# Altium project flight_controller.PrjPcb (part 1 of 3)
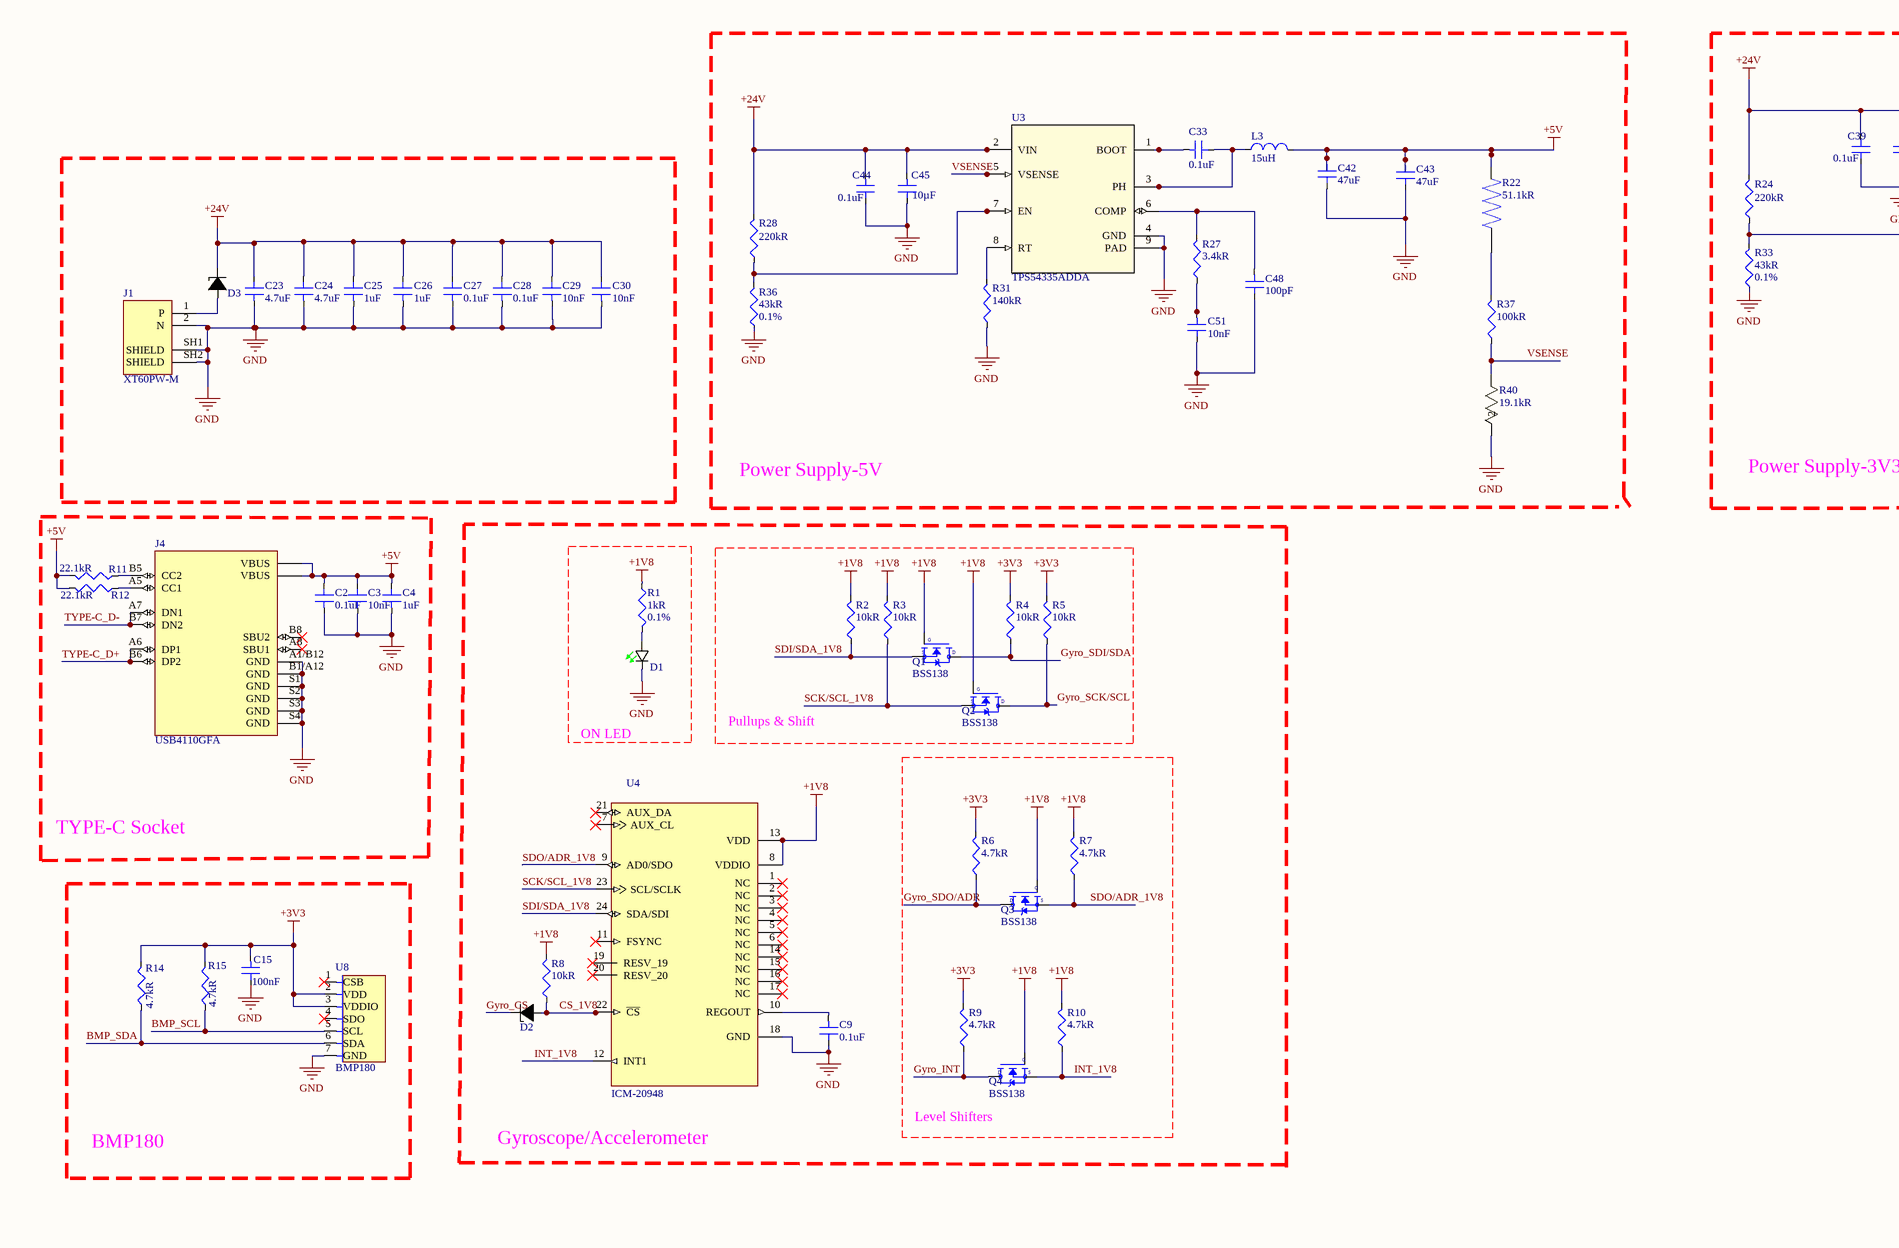
[diagram p0: Sheet1.SchDoc, top left]
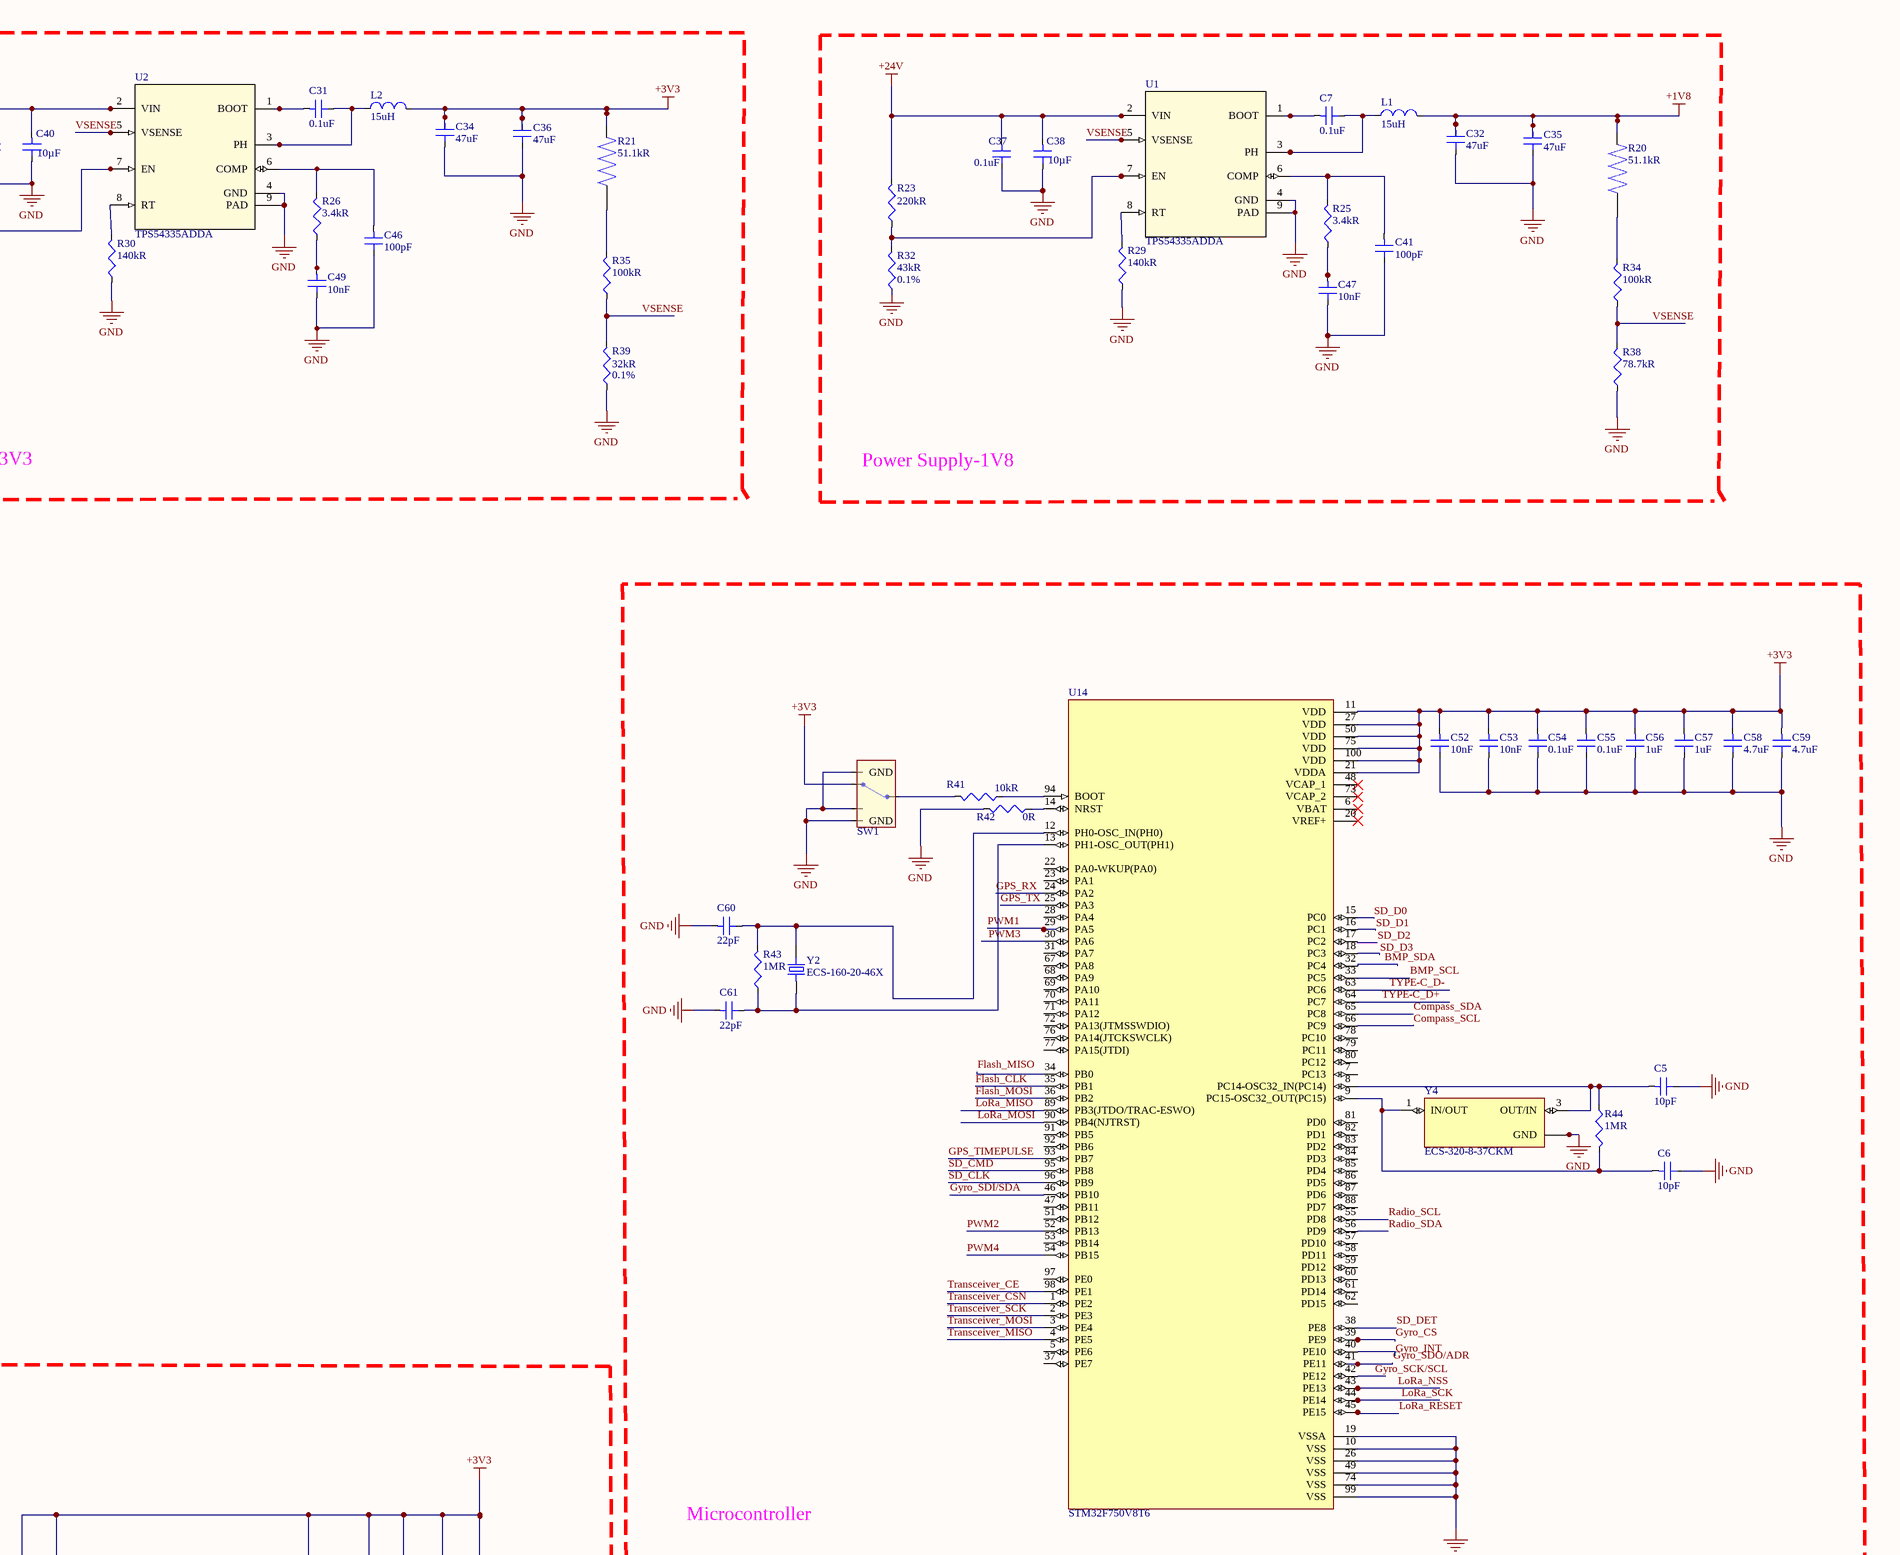
[diagram p1: Sheet1.SchDoc, top right]
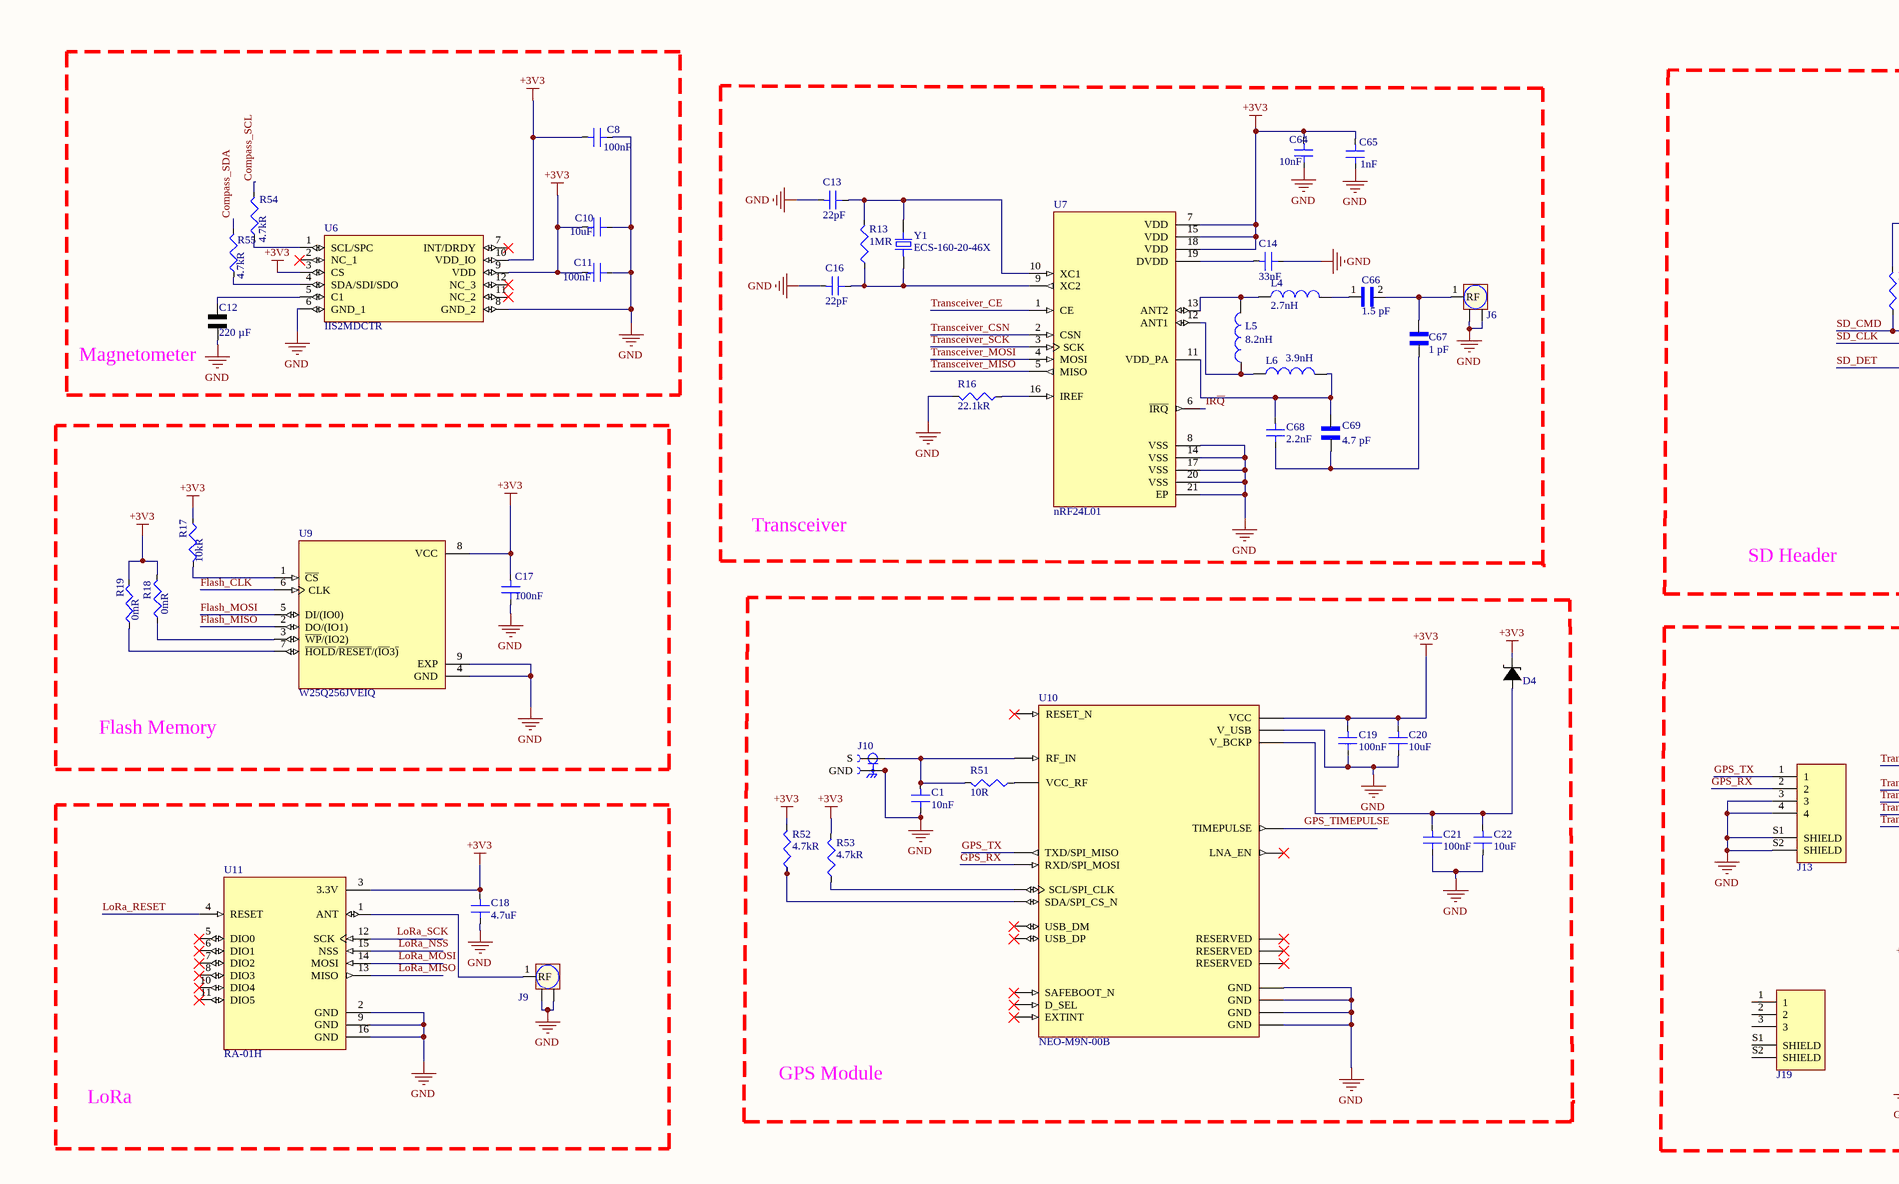
[diagram p2: Sheet1.SchDoc, bottom left]
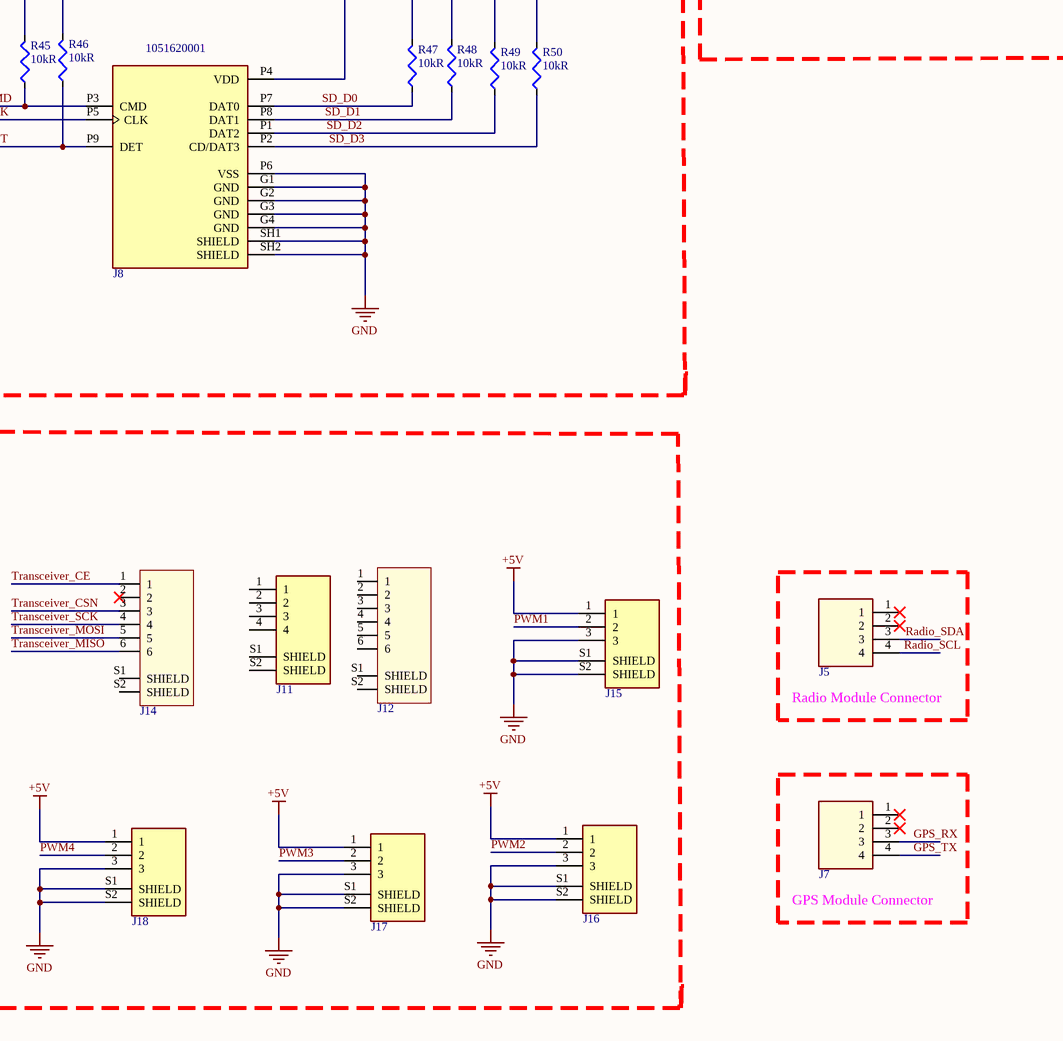
[diagram p3: Sheet1.SchDoc, bottom right]
1 sheet, 167 parts. Net scope: global (net labels, ports and power ports of the same name join across sheets).
Board file: PCB1.PcbDoc

## Sheet Sheet1.SchDoc
size A1; SheetNumber: 1; SheetTotal: 1

### Parts
C1  value 10nF  [C 0402 (1005 Metric)]  (hidden comment: GRM155R71H103MA88D)
C2  value 0.1uF  [C 0402 (1005 Metric)]  (hidden comment: GCM155L81E104KE02D)
C3  value 10nF  [C 0402 (1005 Metric)]  (hidden comment: GRM155R71H103MA88D)
C4  value 1uF  [C 0402 (1005 Metric)]  (hidden comment: GRM152R60J105ME15D)
C5  value 10pF  [C 0603 (1608 Metric)]  (hidden comment: GCM1885C2A100JA16J)
C6  value 10pF  [C 0603 (1608 Metric)]  (hidden comment: GCM1885C2A100JA16J)
C7  value 0.1uF  [C 0402 (1005 Metric)]  (hidden comment: GCM155L81E104KE02D)
C8  value 100nF  [C 0201 (0603 Metric)]  (hidden comment: GMC02X7R104K10NT)
C9  value 0.1uF  [C 0402 (1005 Metric)]  (hidden comment: GCM155L81E104KE02D)
C10  value 10uF  [C 0402 (1005 Metric)]  (hidden comment: GRM155R61A106ME11D)
C11  value 100nF  [C 0201 (0603 Metric)]  (hidden comment: GMC02X7R104K10NT)
C12  220 µF  [CAPC3216X190N]
C13  value 22pF  [C 0402 (1005 Metric)]  (hidden comment: GCM1555C1H220FA16J)
C14  value 33nF  [C 0402 (1005 Metric)]  (hidden comment: GCM155R71C333KA37D)
C15  value 100nF  [C 0201 (0603 Metric)]  (hidden comment: GMC02X7R104K10NT)
C16  value 22pF  [C 0402 (1005 Metric)]  (hidden comment: GCM1555C1H220FA16J)
C17  value 100nF  [C 0201 (0603 Metric)]  (hidden comment: GMC02X7R104K10NT)
C18  value 4.7uF  [C 0201 (0603 Metric)]  (hidden comment: GRM035R60J475ME15J)
C19  value 100nF  [C 0201 (0603 Metric)]  (hidden comment: GMC02X7R104K10NT)
C20  value 10uF  [C 0402 (1005 Metric)]  (hidden comment: GRM155R61A106ME11D)
C21  value 100nF  [C 0201 (0603 Metric)]  (hidden comment: GMC02X7R104K10NT)
C22  value 10uF  [C 0402 (1005 Metric)]  (hidden comment: GRM155R61A106ME11D)
C23  value 4.7uF  [C 0201 (0603 Metric)]  (hidden comment: GRM035R60J475ME15J)
C24  value 4.7uF  [C 0201 (0603 Metric)]  (hidden comment: GRM035R60J475ME15J)
C25  value 1uF  [C 0402 (1005 Metric)]  (hidden comment: GRM152R60J105ME15D)
C26  value 1uF  [C 0402 (1005 Metric)]  (hidden comment: GRM152R60J105ME15D)
C27  value 0.1uF  [C 0402 (1005 Metric)]  (hidden comment: GCM155L81E104KE02D)
C28  value 0.1uF  [C 0402 (1005 Metric)]  (hidden comment: GCM155L81E104KE02D)
C29  value 10nF  [C 0402 (1005 Metric)]  (hidden comment: GRM155R71H103MA88D)
C30  value 10nF  [C 0402 (1005 Metric)]  (hidden comment: GRM155R71H103MA88D)
C31  value 0.1uF  [C 0402 (1005 Metric)]  (hidden comment: GCM155L81E104KE02D)
C32  value 47uF  [C 0805]  (hidden comment: GRM21BR61A476ME15L)
C33  value 0.1uF  [C 0402 (1005 Metric)]  (hidden comment: GCM155L81E104KE02D)
C34  value 47uF  [C 0805]  (hidden comment: GRM21BR61A476ME15L)
C35  value 47uF  [C 0805]  (hidden comment: GRM21BR61A476ME15L)
C36  value 47uF  [C 0805]  (hidden comment: GRM21BR61A476ME15L)
C37  value 0.1uF  [C 0402 (1005 Metric)]  (hidden comment: GCM155L81E104KE02D)
C38  value 10µF  [C 0603 (1608 Metric)]  (hidden comment: GRM188C81A106MA73D)
C39  value 0.1uF  [C 0402 (1005 Metric)]  (hidden comment: GCM155L81E104KE02D)
C40  value 10µF  [C 0603 (1608 Metric)]  (hidden comment: GRM188C81A106MA73D)
C41  value 100pF  [C 0402 (1005 Metric)]  (hidden comment: C1005NP02A101J050BA)
C42  value 47uF  [C 0805]  (hidden comment: GRM21BR61A476ME15L)
C43  value 47uF  [C 0805]  (hidden comment: GRM21BR61A476ME15L)
C44  value 0.1uF  [C 0402 (1005 Metric)]  (hidden comment: GCM155L81E104KE02D)
C45  value 10µF  [C 0603 (1608 Metric)]  (hidden comment: GRM188C81A106MA73D)
C46  value 100pF  [C 0402 (1005 Metric)]  (hidden comment: C1005NP02A101J050BA)
C47  value 10nF  [C 0402 (1005 Metric)]  (hidden comment: CGA2B2X5R1E103M050BA)
C48  value 100pF  [C 0402 (1005 Metric)]  (hidden comment: C1005NP02A101J050BA)
C49  value 10nF  [C 0402 (1005 Metric)]  (hidden comment: CGA2B2X5R1E103M050BA)
C51  value 10nF  [C 0402 (1005 Metric)]  (hidden comment: CGA2B2X5R1E103M050BA)
C52  value 10nF  [C 0402 (1005 Metric)]  (hidden comment: GRM155R71H103MA88D)
C53  value 10nF  [C 0402 (1005 Metric)]  (hidden comment: GRM155R71H103MA88D)
C54  value 0.1uF  [C 0402 (1005 Metric)]  (hidden comment: GCM155L81E104KE02D)
C55  value 0.1uF  [C 0402 (1005 Metric)]  (hidden comment: GCM155L81E104KE02D)
C56  value 1uF  [C 0402 (1005 Metric)]  (hidden comment: GRM152R60J105ME15D)
C57  value 1uF  [C 0402 (1005 Metric)]  (hidden comment: GRM152R60J105ME15D)
C58  value 4.7uF  [C 0201 (0603 Metric)]  (hidden comment: GRM035R60J475ME15J)
C59  value 4.7uF  [C 0201 (0603 Metric)]  (hidden comment: GRM035R60J475ME15J)
C60  value 22pF  [C 0402 (1005 Metric)]  (hidden comment: GCM1555C1H220FA16J)
C61  value 22pF  [C 0402 (1005 Metric)]  (hidden comment: GCM1555C1H220FA16J)
C64  value 10nF  [C 0402 (1005 Metric)]  (hidden comment: GRM155R71H103MA88D)
C65  value 1nF  [C 0402 (1005 Metric)]  (hidden comment: GCM155R71H102KA37D)
C66  1.5 pF  [CAPC0603X33N]
C67  1 pF  [CAPC1005X55N]
C68  value 2.2nF  [C 0402 (1005 Metric)]  (hidden comment: GCM155R71H222KA37D)
C69  4.7 pF  [CAPC0603X33N]
D1  LTST-S270KGKT  [LTST-S270KGKT]  (value not drawn)
D2  SMF30A  [SOD-123F]  (value not drawn)
D3  SMF30A  [SOD-123F]  (value not drawn)
D4  TDZ5V1J,115  [SC-90, SOD-323F]  (value not drawn)
J1  XT60PW-M  [AMASS_XT60PW-M]
J4  USB4110GFA  [USB4110GFA]
J5  B4B-ZR(LF)(SN)  [B4B-ZR(LF)(SN)]  (value not drawn)
J6  2337019-1  [2337019-1]  (value not drawn)
J7  B4B-ZR(LF)(SN)  [B4B-ZR(LF)(SN)]  (value not drawn)
J8  1051620001  [1051620001]
J9  2337019-1  [2337019-1]  (value not drawn)
J10  20279-001E-03  [IPEX_20279-001E-03]  (value not drawn)
J11  BM04B-GHS-TBT(LF)(SN)(N)  [BM04B-GHS-TBT(LF)(SN)(N)]  (value not drawn)
J12  BM06B-GHS-TBT(LF)(SN)(N)  [BM06B-GHS-TBT(LF)(SN)(N)]  (value not drawn)
J13  BM04B-GHS-TBT(LF)(SN)(N)  [BM04B-GHS-TBT(LF)(SN)(N)]  (value not drawn)
J14  BM06B-GHS-TBT(LF)(SN)(N)  [BM06B-GHS-TBT(LF)(SN)(N)]  (value not drawn)
J15  BM03B-GHS-TBT(LF)(SN)(N)  [BM03B-GHS-TBT(LF)(SN)]  (value not drawn)
J16  BM03B-GHS-TBT(LF)(SN)(N)  [BM03B-GHS-TBT(LF)(SN)]  (value not drawn)
J17  BM03B-GHS-TBT(LF)(SN)(N)  [BM03B-GHS-TBT(LF)(SN)]  (value not drawn)
J18  BM03B-GHS-TBT(LF)(SN)(N)  [BM03B-GHS-TBT(LF)(SN)]  (value not drawn)
J19  BM03B-GHS-TBT(LF)(SN)(N)  [BM03B-GHS-TBT(LF)(SN)]  (value not drawn)
L1  value 15uH  [74438356150]  (hidden comment: 74438356150)
L2  value 15uH  [74438356150]  (hidden comment: 74438356150)
L3  value 15uH  [74438356150]  (hidden comment: 74438356150)
L4  2.7nH  [LQW15AN2N7G8ZD]
L5  8.2nH  [INDC1006X60N]
L6  3.9nH  [INDC0603X33N]
Q1  BSS138  [BSS138]
Q2  BSS138  [BSS138]
Q3  BSS138  [BSS138]
Q4  BSS138  [BSS138]
R1  value 1kR  Tolerance: 0.1%  [R 0402 (1005 Metric)]  (hidden comment: ERA-2ARB102X)
R2  value 10kR  [R 0402 (1005 Metric)]  (hidden comment: ERJ-2GEJ103X)
R3  value 10kR  [R 0402 (1005 Metric)]  (hidden comment: ERJ-2GEJ103X)
R4  value 10kR  [R 0402 (1005 Metric)]  (hidden comment: ERJ-2GEJ103X)
R5  value 10kR  [R 0402 (1005 Metric)]  (hidden comment: ERJ-2GEJ103X)
R6  value 4.7kR  [R 0201 (0603 Metric)]  (hidden comment: ERJ-1GNF4701C)
R7  value 4.7kR  [R 0201 (0603 Metric)]  (hidden comment: ERJ-1GNF4701C)
R8  value 10kR  [R 0402 (1005 Metric)]  (hidden comment: ERJ-2GEJ103X)
R9  value 4.7kR  [R 0201 (0603 Metric)]  (hidden comment: ERJ-1GNF4701C)
R10  value 4.7kR  [R 0201 (0603 Metric)]  (hidden comment: ERJ-1GNF4701C)
R11  value 22.1kR  [R 0402 (1005 Metric)]  (hidden comment: RT0402BRE0722K1L)
R12  value 22.1kR  [R 0402 (1005 Metric)]  (hidden comment: RT0402BRE0722K1L)
R13  value 1MR  [R 0402 (1005 Metric)]  (hidden comment: ERJ-2RKF1004X)
R14  value 4.7kR  [R 0402 (1005 Metric)]  (hidden comment: ERJ-2RKF4701X)
R15  value 4.7kR  [R 0402 (1005 Metric)]  (hidden comment: ERJ-2RKF4701X)
R16  value 22.1kR  [R 0402 (1005 Metric)]  (hidden comment: RT0402BRE0722K1L)
R17  value 10kR  [R 0402 (1005 Metric)]  (hidden comment: ERJ-2GEJ103X)
R18  value 0mR  [R 0402 (1005 Metric)]  (hidden comment: ERJ-2GE0R00X)
R19  value 0mR  [R 0402 (1005 Metric)]  (hidden comment: ERJ-2GE0R00X)
R20  51.1kR  [RES_ERA2AEB5112X]
R21  51.1kR  [RES_ERA2AEB5112X]
R22  51.1kR  [RES_ERA2AEB5112X]
R23  value 220kR  [R 0402 (1005 Metric)]  (hidden comment: RT0402BRD07220KL)
R24  value 220kR  [R 0402 (1005 Metric)]  (hidden comment: RT0402BRD07220KL)
R25  value 3.4kR  [R 0402 (1005 Metric)]  (hidden comment: ERJ-2RKF3401X)
R26  value 3.4kR  [R 0402 (1005 Metric)]  (hidden comment: ERJ-2RKF3401X)
R27  value 3.4kR  [R 0402 (1005 Metric)]  (hidden comment: ERJ-2RKF3401X)
R28  value 220kR  [R 0402 (1005 Metric)]  (hidden comment: RT0402BRD07220KL)
R29  value 140kR  [R 0402 (1005 Metric)]  (hidden comment: RT0402BRD07140KL)
R30  value 140kR  [R 0402 (1005 Metric)]  (hidden comment: RT0402BRD07140KL)
R31  value 140kR  [R 0402 (1005 Metric)]  (hidden comment: RT0402BRD07140KL)
R32  value 43kR  Tolerance: 0.1%  [R 0402 (1005 Metric)]  (hidden comment: ERA-2APB433X)
R33  value 43kR  Tolerance: 0.1%  [R 0402 (1005 Metric)]  (hidden comment: ERA-2APB433X)
R34  value 100kR  [R 0402 (1005 Metric)]  (hidden comment: ERA-2AEB104X)
R35  value 100kR  [R 0402 (1005 Metric)]  (hidden comment: ERA-2AEB104X)
R36  value 43kR  Tolerance: 0.1%  [R 0402 (1005 Metric)]  (hidden comment: ERA-2APB433X)
R37  value 100kR  [R 0402 (1005 Metric)]  (hidden comment: ERA-2AEB104X)
R38  value 78.7kR  [R 0402 (1005 Metric)]  (hidden comment: RC0402FR-0778K7L)
R39  value 32kR  Resistance Tolerance: 0.1%  [R 0402 (1005 Metric)]  (hidden comment: TNPW040232K0BEED)
R40  19.1kR  [RES_ERA3A_0603_PAN]
R41  value 10kR  [R 0402 (1005 Metric)]  (hidden comment: ERJ-2GEJ103X)
R42  value 0R  [R 0201 (0603 Metric)]  (hidden comment: RMCF0201ZT0R00)
R43  value 1MR  [R 0402 (1005 Metric)]  (hidden comment: ERJ-2RKF1004X)
R44  value 1MR  [R 0402 (1005 Metric)]  (hidden comment: ERJ-2RKF1004X)
R45  value 10kR  [R 0402 (1005 Metric)]  (hidden comment: ERJ-2GEJ103X)
R46  value 10kR  [R 0402 (1005 Metric)]  (hidden comment: ERJ-2GEJ103X)
R47  value 10kR  [R 0402 (1005 Metric)]  (hidden comment: ERJ-2GEJ103X)
R48  value 10kR  [R 0402 (1005 Metric)]  (hidden comment: ERJ-2GEJ103X)
R49  value 10kR  [R 0402 (1005 Metric)]  (hidden comment: ERJ-2GEJ103X)
R50  value 10kR  [R 0402 (1005 Metric)]  (hidden comment: ERJ-2GEJ103X)
R51  value 10R  [R 0402 (1005 Metric)]  (hidden comment: ERJ-2RKF10R0X)
R52  value 4.7kR  [R 0201 (0603 Metric)]  (hidden comment: ERJ-1GNF4701C)
R53  value 4.7kR  [R 0201 (0603 Metric)]  (hidden comment: ERJ-1GNF4701C)
R54  value 4.7kR  [R 0201 (0603 Metric)]  (hidden comment: ERJ-1GNF4701C)
R55  value 4.7kR  [R 0201 (0603 Metric)]  (hidden comment: ERJ-1GNF4701C)
SW1  1825232-1  [1825232-1]  (value not drawn)
U1  TPS54335ADDA  [DDA0008E_L]
U2  TPS54335ADDA  [DDA0008E_L]
U3  TPS54335ADDA  [DDA0008E_L]
U4  ICM-20948  [ICM-20948]
U6  IIS2MDCTR  [IIS2MDCTR]
U7  nRF24L01  [QFN50P400X400X95-21N]
U8  BMP180  [BMP180]
U9  W25Q256JVEIQ  [SON127P600X800X80-9N]
U10  NEO-M9N-00B  [XCVR_NEO-M9N-00B]
U11  RA-01H  [XCVR_RA-01H]
U14  STM32F750V8T6  [QFP50P1600X1600X160-100N]
Y1  ECS-160-20-46X  [XTAL_ECS-160-20-46X]
Y2  ECS-160-20-46X  [XTAL_ECS-160-20-46X]
Y4  ECS-320-8-37CKM  [XTAL_ECS-320-8-37CKM]

### Blocks framed on the sheet
TYPE-C Socket: C2-C4 J4 R11 R12
Gyroscope/Accelerometer: C9 D2 Q3 Q4 R6-R10 U4
ON LED: D1 R1
Pullups & Shift: Q1 Q2 R2-R5
BMP180: C15 R14 R15 U8
Magnetometer: C8 C10-C12 R54 R55 U6
Flash Memory: C17 R17-R19 U9
Radio Module Connector: J5
LoRa: C18 J9 U11
GPS Module Connector: J7

### Nets
+1V8: C32.1(B) C35.1(B) L1.1(B) Q1.1(G) Q2.1(G) Q3.1(G) Q4.1(G) R1.2(A) R2.1(B) R3.1(B) R7.1(B) R8.1(B) R10.1(B) R20.2 U4.8(VDDIO) U4.13(VDD)
+3V3: C8.1(B) C10.1(B) C11.1(B) C15.1(B) C17.1(B) C18.1(B) C19.1(B) C20.1(B) C34.1(B) C36.1(B) C52.1(B) C53.1(B) C54.1(B) C55.1(B) C56.1(B) C57.1(B) C58.1(B) C59.1(B) C64.1(B) C65.1(B) D4.1(C) J8.P4(VDD) L2.1(B) R4.1(B) R5.1(B) R6.1(B) R9.1(B) R14.1(B) R15.1(B) R17.2(A) R18.1(B) R19.1(B) R21.2 R45.1(B) R46.1(B) R47.1(B) R48.1(B) R49.1(B) R50.1(B) R52.1(B) R53.1(B) SW1.3 U6.3(CS) U6.9(VDD) U6.10(VDD_IO) U7.7(VDD) U7.15(VDD) U7.18(VDD) U8.2(VDD) U8.3(VDDIO) U9.8(VCC) U10.23(VCC) U11.3(3.3V) U14.11(VDD) U14.21(VDDA) U14.27(VDD) U14.50(VDD) U14.75(VDD) U14.100(VDD)
+5V: C2.2(A) C3.2(A) C4.2(A) C42.1(B) C43.1(B) J4.?1(VBUS) J4.?2(VBUS) J15.1 J16.1 J17.1 J18.1 L3.1(B) R11.1(B) R12.1(B) R22.2
+24V: C23.2(A) C24.2(A) C25.2(A) C26.2(A) C27.2(A) C28.2(A) C29.2(A) C30.2(A) C37.1(B) C38.1(B) C39.1(B) C40.1(B) C44.1(B) C45.1(B) D3.1(C) R23.1(B) R24.1(B) R28.1(B) U1.2(VIN) U2.2(VIN) U3.2(VIN)
GND: C1.2(A) C2.1(B) C3.1(B) C4.1(B) C5.2(A) C6.2(A) C8.2(A) C9.2(A) C10.2(A) C11.2(A) C12.1 C13.1(B) C14.2(A) C15.2(A) C16.1(B) C17.2(A) C18.2(A) C19.2(A) C20.2(A) C21.2(A) C22.2(A) C23.1(B) C24.1(B) C25.1(B) C26.1(B) C27.1(B) C28.1(B) C29.1(B) C30.1(B) C32.2(A) C34.2(A) C35.2(A) C36.2(A) C37.2(A) C38.2(A) C39.2(A) C40.2(A) C41.2(A) C42.2(A) C43.2(A) C44.2(A) C45.2(A) C46.2(A) C47.2(A) C48.2(A) C49.2(A) C51.2(A) C52.2(A) C53.2(A) C54.2(A) C55.2(A) C56.2(A) C57.2(A) C58.2(A) C59.2(A) C60.1(B) C61.1(B) C64.2(A) C65.2(A) D1.1(C) J1.2(N) J1.SH1(SHIELD) J1.SH2(SHIELD) J4.A1/B12(GND) J4.B1/A12(GND) J4.S1(GND) J4.S2(GND) J4.S3(GND) J4.S4(GND) J6.G1(GND) J6.G2(GND) J8.G1(GND) J8.G2(GND) J8.G3(GND) J8.G4(GND) J8.P6(VSS) J8.SH1(SHIELD) J8.SH2(SHIELD) J9.G1(GND) J9.G2(GND) J10.2(GROUND) J10.3(GND) J13.3 J13.4 J13.S1(SHIELD) J13.S2(SHIELD) J15.3 J15.S1(SHIELD) J15.S2(SHIELD) J16.3 J16.S1(SHIELD) J16.S2(SHIELD) J17.3 J17.S1(SHIELD) J17.S2(SHIELD) J18.3 J18.S1(SHIELD) J18.S2(SHIELD) R16.1(B) R29.2(A) R30.2(A) R31.2(A) R32.2(A) R33.2(A) R36.2(A) R38.2(A) R39.2(A) R40.2 R42.1(B) SW1.1 SW1.4(GND) SW1.5(GND) U1.4(GND) U1.9(PAD) U2.4(GND) U2.9(PAD) U3.4(GND) U3.9(PAD) U4.18(GND) U6.6(GND_1) U6.8(GND_2) U7.8(VSS) U7.14(VSS) U7.17(VSS) U7.20(VSS) U7.21(EP) U8.7(GND) U9.4(GND) U9.9(EXP) U10.7(V_USB) U10.10(GND) U10.12(GND) U10.13(GND) U10.24(GND) U11.2(GND) U11.9(GND) U11.16(GND) U14.10(VSS) U14.19(VSSA) U14.26(VSS) U14.49(VSS) U14.74(VSS) U14.99(VSS) Y4.2(GND) Y4.4(GND)
BMP_SCL: R15.2(A) U8.5(SCL) U14.33(PC5)
BMP_SDA: R14.2(A) U8.6(SDA) U14.32(PC4)
Compass_SCL: R54.1(B) U14.66(PC9)
Compass_SDA: R55.1(B) U14.65(PC8)
CS_1V8: D2.2(A) R8.2(A) U4.22(~{CS})
Flash_CLK: U9.6(CLK) U14.35(PB1)
Flash_MISO: U9.2(DO/(IO1)) U14.34(PB0)
Flash_MOSI: U9.5(DI/(IO0)) U14.36(PB2)
GPS_RX: J7.3 J13.2 U10.21(RXD/SPI_MOSI) U14.24(PA2)
GPS_TIMEPULSE: U10.3(TIMEPULSE) U14.93(PB7)
GPS_TX: J7.4 J13.1 U10.20(TXD/SPI_MISO) U14.25(PA3)
Gyro_CS: D2.1(C) U14.39(PE9)
Gyro_INT: Q4.3(D) R9.2(A) U14.40(PE10)
Gyro_SCK/SCL: Q2.3(D) R5.2(A) U14.42(PE12)
Gyro_SDI/SDA: Q1.3(D) R4.2(A) U14.46(PB10)
Gyro_SDO/ADR: Q3.3(D) R6.2(A) U14.41(PE11)
INT_1V8: Q4.2(S) R10.2(A) U4.12(INT1)
IR~{Q}: U7.6(~{IRQ})
LoRa_MISO: U11.13(MISO) U14.89(PB3(JTDO/TRAC-ESWO))
LoRa_MOSI: U11.14(MOSI) U14.90(PB4(NJTRST))
LoRa_NSS: U11.15(NSS) U14.43(PE13)
LoRa_RESET: U11.4(RESET) U14.45(PE15)
LoRa_SCK: U11.12(SCK) U14.44(PE14)
PWM1: J15.2 U14.29(PA5)
PWM2: J16.2 U14.52(PB13)
PWM3: J17.2 U14.30(PA6)
PWM4: J18.2 U14.54(PB15)
Radio_SCL: J5.4 U14.55(PD8)
Radio_SDA: J5.3 U14.56(PD9)
SCK/SCL_1V8: Q2.2(S) R3.2(A) U4.23(SCL/SCLK)
SD_CLK: J8.P5(CLK) U14.96(PB9)
SD_CMD: J8.P3(CMD) R45.2(A) U14.95(PB8)
SD_D0: J8.P7(DAT0) R47.2(A) U14.15(PC0)
SD_D1: J8.P8(DAT1) R48.2(A) U14.16(PC1)
SD_D2: J8.P1(DAT2) R49.2(A) U14.17(PC2)
SD_D3: J8.P2(CD/DAT3) R50.2(A) U14.18(PC3)
SD_DET: J8.P9(DET) R46.2(A) U14.38(PE8)
SDI/SDA_1V8: Q1.2(S) R2.2(A) U4.24(SDA/SDI)
SDO/ADR_1V8: Q3.2(S) R7.2(A) U4.9(AD0/SDO)
Transceiver_CE: J14.1 U7.1(CE) U14.98(PE1)
Transceiver_CSN: J14.3 U7.2(CSN) U14.1(PE2)
Transceiver_MISO: J14.6 U7.5(MISO) U14.4(PE5)
Transceiver_MOSI: J14.5 U7.4(MOSI) U14.3(PE4)
Transceiver_SCK: J14.4 U7.3(SCK) U14.2(PE3)
TYPE-C_D+: J4.A6(DP1) J4.B6(DP2) U14.64(PC7)
TYPE-C_D-: J4.A7(DN1) J4.B7(DN2) U14.63(PC6)
VSENSE: R34.2(A) R35.2(A) R37.2(A) R38.1(B) R39.1(B) R40.1 U1.5(VSENSE) U2.5(VSENSE) U3.5(VSENSE)
NetC1_1: C1.1(B) J10.1(S) R51.1(B) U10.11(RF_IN)
NetC5_1: C5.1(B) R44.2(A) U14.8(PC14-OSC32_IN(PC14)) Y4.3(OUT/IN)
NetC6_1: C6.1(B) R44.1(B) U14.9(PC15-OSC32_OUT(PC15)) Y4.1(IN/OUT)
NetC7_1: C7.1(B) U1.1(BOOT)
NetC7_2: C7.2(A) L1.2(A) U1.3(PH)
NetC9_1: C9.1(B) U4.10(REGOUT)
NetC12_2: C12.2 U6.5(C1)
NetC13_2: C13.2(A) R13.1(B) U7.10(XC1) Y1.2
NetC14_1: C14.1(B) U7.19(DVDD)
NetC16_2: C16.2(A) R13.2(A) U7.9(XC2) Y1.1
NetC21_1: C21.1(B) C22.1(B) D4.2(A) U10.22(V_BCKP)
NetC31_1: C31.1(B) U2.1(BOOT)
NetC31_2: C31.2(A) L2.2(A) U2.3(PH)
NetC33_1: C33.1(B) U3.1(BOOT)
NetC33_2: C33.2(A) L3.2(A) U3.3(PH)
NetC41_1: C41.1(B) R25.1(B) U1.6(COMP)
NetC46_1: C46.1(B) R26.1(B) U2.6(COMP)
NetC47_1: C47.1(B) R25.2(A)
NetC48_1: C48.1(B) R27.1(B) U3.6(COMP)
NetC49_1: C49.1(B) R26.2(A)
NetC51_1: C51.1(B) R27.2(A)
NetC60_2: C60.2(A) R43.1(B) U14.12(PH0-OSC_IN(PH0)) Y2.2
NetC61_2: C61.2(A) R43.2(A) U14.13(PH1-OSC_OUT(PH1)) Y2.1
NetC66_1: C66.1 L4.2
NetC66_2: C66.2 C67.2 J6.1(RF)
NetC67_1: C67.1 C68.2(A) C69.1
NetC68_1: C68.1(B) C69.2 L6.2 U7.11(VDD_PA)
NetD1_2: D1.2(A) R1.1(B)
NetD3_2: D3.2(A) J1.1(P)
NetJ4_A5: J4.A5(CC1) R12.2(A)
NetJ4_B5: J4.B5(CC2) R11.2(A)
NetJ9_1: J9.1(RF) U11.1(ANT)
NetL4_1: L4.1 L5.2 U7.13(ANT2)
NetL5_1: L5.1 L6.1 U7.12(ANT1)
NetR16_2: R16.2(A) U7.16(IREF)
NetR17_1: R17.1(B) U9.1(~{CS})
NetR18_2: R18.2(A) U9.3(~{WP}/(IO2))
NetR19_2: R19.2(A) U9.7(~{HOLD}/~{RESET}/(~{IO}3~{)})
NetR20_1: R20.1 R34.1(B)
NetR21_1: R21.1 R35.1(B)
NetR22_1: R22.1 R37.1(B)
NetR23_2: R23.2(A) R32.1(B) U1.7(EN)
NetR24_2: R24.2(A) R33.1(B) U2.7(EN)
NetR28_2: R28.2(A) R36.1(B) U3.7(EN)
NetR29_1: R29.1(B) U1.8(RT)
NetR30_1: R30.1(B) U2.8(RT)
NetR31_1: R31.1(B) U3.8(RT)
NetR41_1: R41.1(B) SW1.2
NetR41_2: R41.2(A) U14.94(BOOT)
NetR42_2: R42.2(A) U14.14(NRST)
NetR51_2: R51.2(A) U10.9(VCC_RF)
NetR52_2: R52.2(A) U10.18(SDA/SPI_CS_N)
NetR53_2: R53.2(A) U10.19(SCL/SPI_CLK)
NetR54_2: R54.2(A) U6.1(SCL/SPC)
NetR55_2: R55.2(A) U6.4(SDA/SDI/SDO)

Not connected (* = marked no-connect by the designer): J4 A8(SBU1)* B8(SBU2)*; J5 1* 2*; J7 1* 2*; J11 1 2 3 4 S1(SHIELD) S2(SHIELD); J12 1 2 3 4 5 6 S1(SHIELD) S2(SHIELD); J14 2* S1(SHIELD) S2(SHIELD); J19 1 2 3 S1(SHIELD) S2(SHIELD); U4 1(NC)* 2(NC)* 3(NC)* 4(NC)* 5(NC)* 6(NC)* 7(AUX_CL)* 11(FSYNC)* 14(NC)* 15(NC)* 16(NC)* 17(NC)* 19(RESV_19)* 20(RESV_20)* 21(AUX_DA)*; U6 2(NC_1)* 7(INT/DRDY)* 11(NC_2)* 12(NC_3)*; U8 1(CSB)* 4(SDO)*; U10 1(SAFEBOOT_N)* 2(D_SEL)* 4(EXTINT)* 5(USB_DM)* 6(USB_DP)* 8(RESET_N)* 14(LNA_EN)* 15(RESERVED)* 16(RESERVED)* 17(RESERVED)*; U11 5(DIO0)* 6(DIO1)* 7(DIO2)* 8(DIO3)* 10(DIO4)* 11(DIO5)*; U14 5(PE6) 6(VBAT)* 7(PC13) 20(VREF+)* 22(PA0-WKUP(PA0)) 23(PA1) 28(PA4) 31(PA7) 37(PE7) 47(PB11) 48(VCAP_1)* 51(PB12) 53(PB14) 57(PD10) 58(PD11) 59(PD12) 60(PD13) 61(PD14) 62(PD15) 67(PA8) 68(PA9) 69(PA10) 70(PA11) 71(PA12) 72(PA13(JTMSSWDIO)) 73(VCAP_2)* 76(PA14(JTCKSWCLK)) 77(PA15(JTDI)) 78(PC10) 79(PC11) 80(PC12) 81(PD0) 82(PD1) 83(PD2) 84(PD3) 85(PD4) 86(PD5) 87(PD6) 88(PD7) 91(PB5) 92(PB6) 97(PE0)

### Notes on the sheet
- Power Supply-3V3
- Power Supply-1V8
- Power Supply-5V
- (near Q4) Level Shifters
- Microcontroller
- Transceiver
- SD Header
- GPS Module